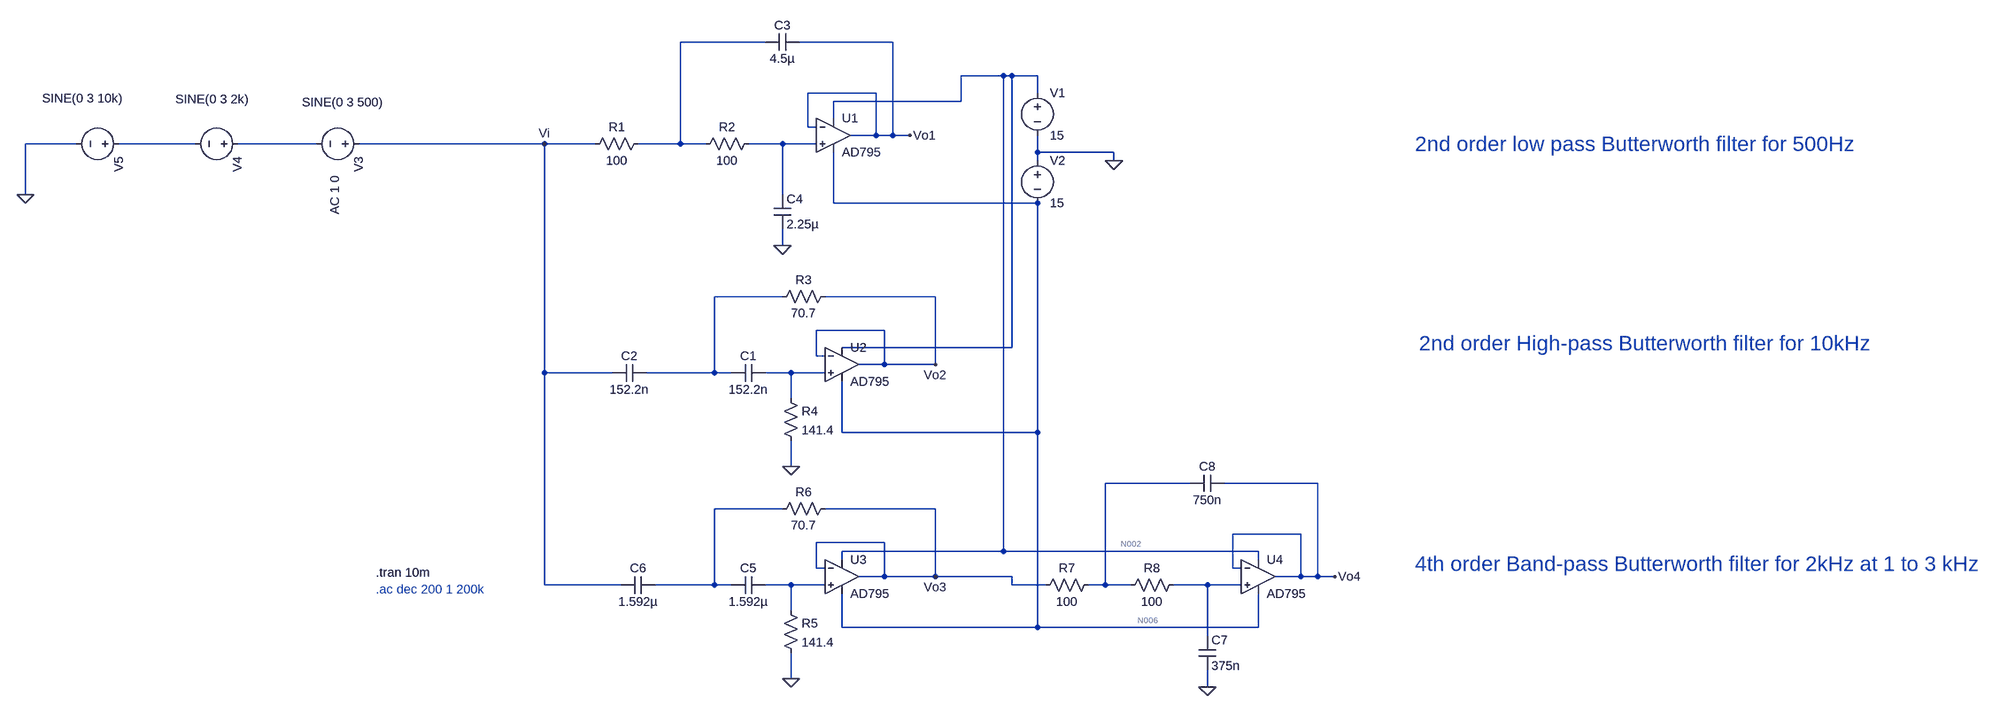
[diagram p0: schematic HW2_Filter.asc]
HW2_Filter.asc, the LTspice schematic file:
Version 4
SHEET 1 3324 1220
WIRE 592 -16 432 -16
WIRE 832 -16 656 -16
WIRE 1040 48 960 48
WIRE 1056 48 1040 48
WIRE 1104 48 1056 48
WIRE 800 80 672 80
WIRE 1104 80 1104 48
WIRE 960 96 960 48
WIRE 960 96 720 96
WIRE 720 128 720 96
WIRE 672 144 672 80
WIRE 688 144 672 144
WIRE 800 160 800 80
WIRE 800 160 752 160
WIRE 832 160 832 -16
WIRE 832 160 800 160
WIRE 864 160 832 160
WIRE -832 176 -928 176
WIRE -608 176 -752 176
WIRE -320 176 -528 176
WIRE 176 176 -240 176
WIRE 272 176 176 176
WIRE 432 176 432 -16
WIRE 432 176 352 176
WIRE 480 176 432 176
WIRE 624 176 560 176
WIRE 688 176 624 176
WIRE 1104 192 1104 160
WIRE 1248 192 1104 192
WIRE 1104 208 1104 192
WIRE 1248 208 1248 192
WIRE -928 272 -928 176
WIRE 624 272 624 176
WIRE 720 288 720 192
WIRE 1104 288 720 288
WIRE 624 368 624 336
WIRE 624 464 496 464
WIRE 912 464 704 464
WIRE 816 528 688 528
WIRE 1056 560 1056 48
WIRE 1056 560 736 560
WIRE 688 576 688 528
WIRE 704 576 688 576
WIRE 816 592 816 528
WIRE 816 592 768 592
WIRE 912 592 912 464
WIRE 912 592 816 592
WIRE 176 608 176 176
WIRE 304 608 176 608
WIRE 496 608 496 464
WIRE 496 608 368 608
WIRE 528 608 496 608
WIRE 640 608 592 608
WIRE 704 608 640 608
WIRE 640 656 640 608
WIRE 736 720 736 624
WIRE 1104 720 1104 288
WIRE 1104 720 736 720
WIRE 640 784 640 736
WIRE 1392 816 1232 816
WIRE 1632 816 1456 816
WIRE 624 864 496 864
WIRE 912 864 704 864
WIRE 1600 912 1472 912
WIRE 816 928 688 928
WIRE 1040 944 1040 48
WIRE 1040 944 736 944
WIRE 1520 944 1040 944
WIRE 736 960 736 944
WIRE 1520 960 1520 944
WIRE 688 976 688 928
WIRE 704 976 688 976
WIRE 1472 976 1472 912
WIRE 1488 976 1472 976
WIRE 816 992 816 928
WIRE 816 992 768 992
WIRE 912 992 912 864
WIRE 912 992 816 992
WIRE 1056 992 912 992
WIRE 1600 992 1600 912
WIRE 1600 992 1552 992
WIRE 1632 992 1632 816
WIRE 1632 992 1600 992
WIRE 1664 992 1632 992
WIRE 176 1008 176 608
WIRE 320 1008 176 1008
WIRE 496 1008 496 864
WIRE 496 1008 384 1008
WIRE 528 1008 496 1008
WIRE 640 1008 592 1008
WIRE 704 1008 640 1008
WIRE 1056 1008 1056 992
WIRE 1120 1008 1056 1008
WIRE 1232 1008 1232 816
WIRE 1232 1008 1200 1008
WIRE 1280 1008 1232 1008
WIRE 1424 1008 1360 1008
WIRE 1488 1008 1424 1008
WIRE 640 1056 640 1008
WIRE 736 1088 736 1024
WIRE 1104 1088 1104 720
WIRE 1104 1088 736 1088
WIRE 1520 1088 1520 1024
WIRE 1520 1088 1104 1088
WIRE 1424 1104 1424 1008
WIRE 640 1184 640 1136
WIRE 1424 1200 1424 1168
FLAG 624 368 0
FLAG 1248 208 0
FLAG 864 160 Vo1
FLAG 176 176 Vi
FLAG 640 784 0
FLAG 912 592 Vo2
FLAG 640 1184 0
FLAG 912 992 Vo3
FLAG 1424 1200 0
FLAG 1664 992 Vo4
FLAG -928 272 0
SYMBOL OpAmps\\AD795 720 96 R0
SYMATTR InstName U1
SYMBOL res 368 160 R90
WINDOW 0 0 56 VBottom 2
WINDOW 3 32 56 VTop 2
SYMATTR InstName R1
SYMATTR Value 100
SYMBOL res 576 160 R90
WINDOW 0 0 56 VBottom 2
WINDOW 3 32 56 VTop 2
SYMATTR InstName R2
SYMATTR Value 100
SYMBOL cap 608 272 R0
SYMATTR InstName C4
SYMATTR Value 2.25µ
SYMBOL cap 656 -32 R90
WINDOW 0 0 32 VBottom 2
WINDOW 3 32 32 VTop 2
SYMATTR InstName C3
SYMATTR Value 4.5µ
SYMBOL voltage 1104 64 R0
WINDOW 123 0 0 Left 0
WINDOW 39 0 0 Left 0
SYMATTR InstName V1
SYMATTR Value 15
SYMBOL voltage 1104 192 R0
WINDOW 123 0 0 Left 0
WINDOW 39 0 0 Left 0
SYMATTR InstName V2
SYMATTR Value 15
SYMBOL voltage -224 176 R90
WINDOW 3 -78 -30 VRight 2
WINDOW 39 0 0 Left 0
WINDOW 123 60 61 Left 2
SYMATTR Value SINE(0 3 500)
SYMATTR Value2 AC 1 0
SYMATTR InstName V3
SYMBOL voltage -512 176 R90
WINDOW 3 -84 -4 VRight 2
WINDOW 39 0 0 Left 0
SYMATTR Value SINE(0 3 2k)
SYMATTR InstName V4
SYMATTR Value2 AC 0 0
SYMBOL voltage -736 176 R90
WINDOW 3 -86 9 VRight 2
WINDOW 39 0 0 Left 0
SYMATTR Value SINE(0 3 10k)
SYMATTR InstName V5
SYMATTR Value2 AC 0 0
SYMBOL OpAmps\\AD795 736 528 R0
SYMATTR InstName U2
SYMBOL res 624 640 R0
SYMATTR InstName R4
SYMATTR Value 141.4
SYMBOL res 720 448 R90
WINDOW 0 0 56 VBottom 2
WINDOW 3 32 56 VTop 2
SYMATTR InstName R3
SYMATTR Value 70.7
SYMBOL cap 592 592 R90
WINDOW 0 0 32 VBottom 2
WINDOW 3 32 32 VTop 2
SYMATTR InstName C1
SYMATTR Value 152.2n
SYMBOL cap 368 592 R90
WINDOW 0 0 32 VBottom 2
WINDOW 3 32 32 VTop 2
SYMATTR InstName C2
SYMATTR Value 152.2n
SYMBOL OpAmps\\AD795 736 928 R0
SYMATTR InstName U3
SYMBOL res 624 1040 R0
SYMATTR InstName R5
SYMATTR Value 141.4
SYMBOL res 720 848 R90
WINDOW 0 0 56 VBottom 2
WINDOW 3 32 56 VTop 2
SYMATTR InstName R6
SYMATTR Value 70.7
SYMBOL cap 592 992 R90
WINDOW 0 0 32 VBottom 2
WINDOW 3 32 32 VTop 2
SYMATTR InstName C5
SYMATTR Value 1.592µ
SYMBOL cap 384 992 R90
WINDOW 0 0 32 VBottom 2
WINDOW 3 32 32 VTop 2
SYMATTR InstName C6
SYMATTR Value 1.592µ
SYMBOL OpAmps\\AD795 1520 928 R0
SYMATTR InstName U4
SYMBOL res 1216 992 R90
WINDOW 0 0 56 VBottom 2
WINDOW 3 32 56 VTop 2
SYMATTR InstName R7
SYMATTR Value 100
SYMBOL res 1376 992 R90
WINDOW 0 0 56 VBottom 2
WINDOW 3 32 56 VTop 2
SYMATTR InstName R8
SYMATTR Value 100
SYMBOL cap 1408 1104 R0
SYMATTR InstName C7
SYMATTR Value 375n
SYMBOL cap 1456 800 R90
WINDOW 0 0 32 VBottom 2
WINDOW 3 32 32 VTop 2
SYMATTR InstName C8
SYMATTR Value 750n
TEXT -208 984 Left 2 !.tran 10m
TEXT -208 1016 Left 2 ;.ac dec 200 1 200k
TEXT 1880 176 Left 4 ;2nd order low pass Butterworth filter for 500Hz
TEXT 1888 552 Left 4 ;2nd order High-pass Butterworth filter for 10kHz
TEXT 1880 968 Left 4 ;4th order Band-pass Butterworth filter for 2kHz at 1 to 3 kHz

The netlist it stands for:
* HW2_Filter.asc
XU1 N005 Vo1 N002 N006 Vo1 AD795  ; pins In+ In- V+ V- OUT
R1 N001 Vi 100
R2 N005 N001 100
C4 N005 0 2.25µ
C3 Vo1 N001 4.5µ
V1 N002 0 15
V2 0 N006 15
V3 Vi N004 SINE(0 3 500) AC 1 0
V4 N004 N003 SINE(0 3 2k) AC 0 0
V5 N003 0 SINE(0 3 10k) AC 0 0
XU2 N008 Vo2 N002 N006 Vo2 AD795  ; pins In+ In- V+ V- OUT
R4 N008 0 141.4
R3 Vo2 N007 70.7
C1 N008 N007 152.2n
C2 N007 Vi 152.2n
XU3 N011 Vo3 N002 N006 Vo3 AD795  ; pins In+ In- V+ V- OUT
R5 N011 0 141.4
R6 Vo3 N010 70.7
C5 N011 N010 1.592µ
C6 N010 Vi 1.592µ
XU4 N012 Vo4 N002 N006 Vo4 AD795  ; pins In+ In- V+ V- OUT
R7 N009 Vo3 100
R8 N012 N009 100
C7 N012 0 375n
C8 Vo4 N009 750n
.tran 10m
* .ac dec 200 1 200k
* 2nd order low pass Butterworth filter for 500Hz
* 2nd order High-pass Butterworth filter for 10kHz
* 4th order Band-pass Butterworth filter for 2kHz at 1 to 3 kHz
.lib ADI1.lib
.backanno
.end

* Results of the author's LTspice run, read from the files saved beside the schematic
* Operating Point, zero values left out:
*   V(n002) = 15 V
*   V(n006) = -15 V
*   I(V1) = -4.902 mA
*   I(V2) = -4.902 mA
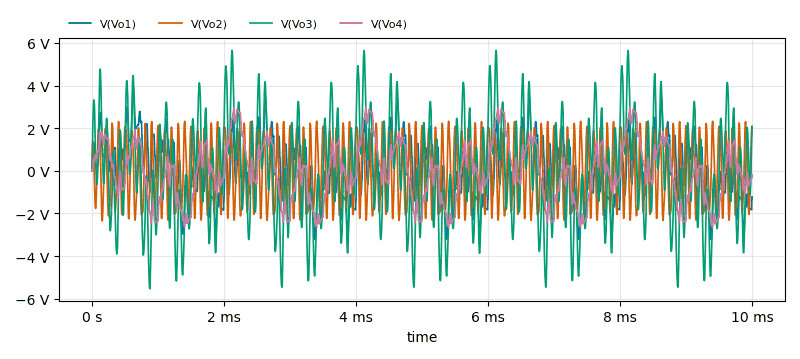
[diagram p1: Transient Analysis of HW2_Filter.asc, plotted from the saved traces]
* Transient Analysis, 1 run:
*   V(Vo1): min -3.21 V, max 3.916 V, average 86 mV, rms 1.365 V, last -1.144 V
*   V(Vo2): min -2.347 V, max 2.33 V, average -519.9 µV, rms 1.496 V, last 2.043 V
*   V(Vo3): min -5.534 V, max 5.651 V, average -41.18 mV, rms 2.376 V, last 2.201 V
*   V(Vo4): min -2.655 V, max 2.984 V, average -51.02 mV, rms 1.369 V, last -133.7 mV